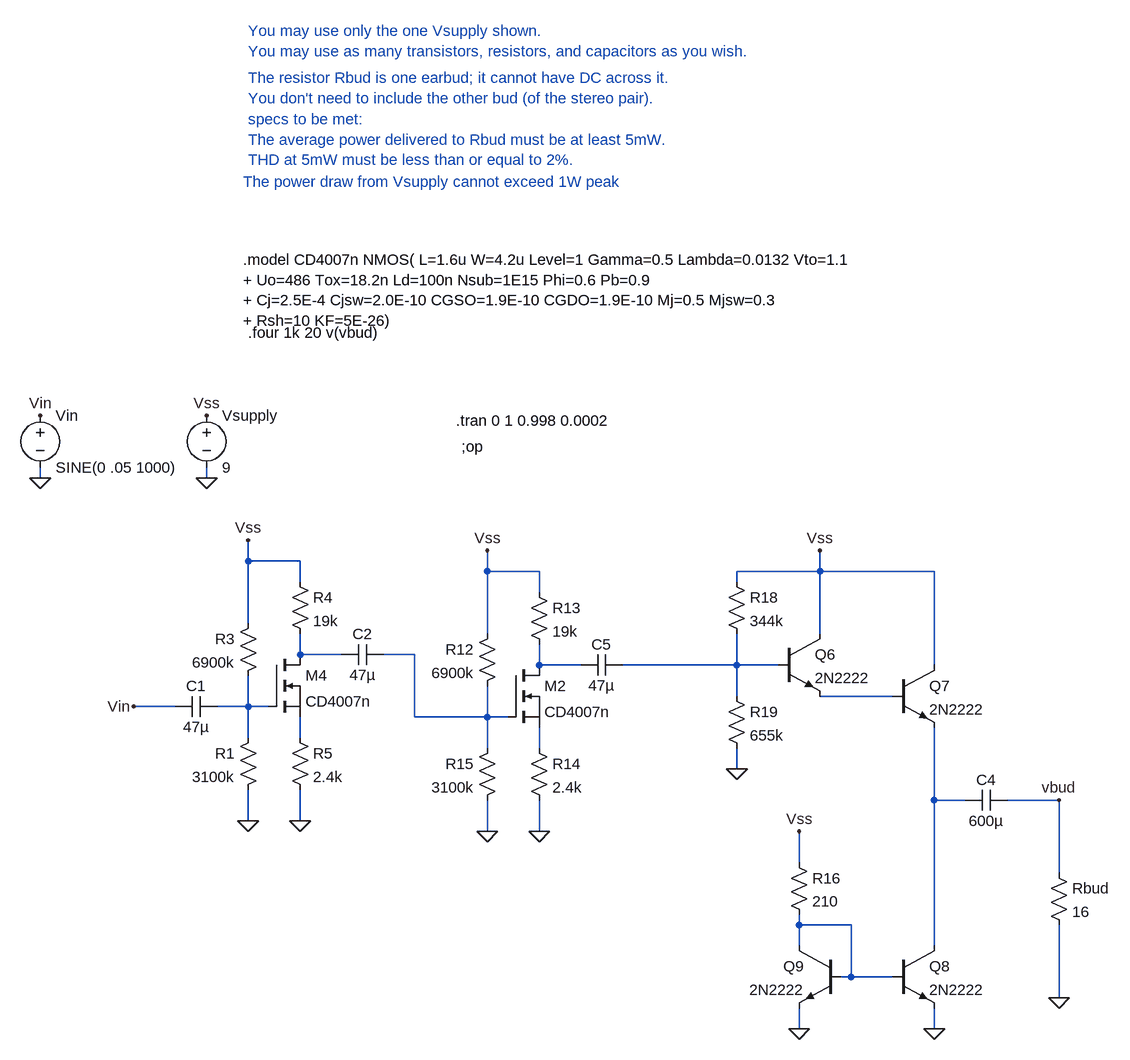
[diagram p0: schematic earbud_amplifier_challenge-1.asc]
earbud_amplifier_challenge-1.asc, the LTspice schematic file:
Version 4
SHEET 1 2240 2180
WIRE 176 1008 176 992
WIRE 432 1008 432 992
WIRE 496 1136 496 1104
WIRE 576 1136 496 1136
WIRE 864 1152 864 1120
WIRE 944 1152 864 1152
WIRE 1376 1152 1376 1120
WIRE 1376 1152 1248 1152
WIRE 1552 1152 1376 1152
WIRE 576 1168 576 1136
WIRE 1248 1168 1248 1152
WIRE 944 1184 944 1152
WIRE 496 1232 496 1136
WIRE 864 1248 864 1152
WIRE 1376 1248 1376 1152
WIRE 576 1280 576 1248
WIRE 640 1280 576 1280
WIRE 752 1280 704 1280
WIRE 944 1296 944 1264
WIRE 1008 1296 944 1296
WIRE 1248 1296 1248 1248
WIRE 1248 1296 1072 1296
WIRE 1312 1296 1248 1296
WIRE 1552 1296 1552 1152
WIRE 1248 1344 1248 1296
WIRE 1488 1344 1376 1344
WIRE 384 1360 320 1360
WIRE 496 1360 496 1312
WIRE 496 1360 448 1360
WIRE 528 1360 496 1360
WIRE 752 1376 752 1280
WIRE 864 1376 864 1328
WIRE 864 1376 752 1376
WIRE 896 1376 864 1376
WIRE 496 1408 496 1360
WIRE 576 1408 576 1376
WIRE 864 1424 864 1376
WIRE 944 1424 944 1392
WIRE 1248 1456 1248 1424
WIRE 1552 1504 1552 1392
WIRE 1600 1504 1552 1504
WIRE 1744 1504 1664 1504
WIRE 496 1536 496 1488
WIRE 576 1536 576 1488
WIRE 864 1552 864 1504
WIRE 944 1552 944 1504
WIRE 1344 1600 1344 1552
WIRE 1744 1616 1744 1504
WIRE 1344 1696 1344 1680
WIRE 1424 1696 1344 1696
WIRE 1344 1728 1344 1696
WIRE 1552 1728 1552 1504
WIRE 1424 1776 1424 1696
WIRE 1424 1776 1408 1776
WIRE 1488 1776 1424 1776
WIRE 1744 1808 1744 1696
WIRE 1344 1856 1344 1824
WIRE 1552 1856 1552 1824
FLAG 176 1008 0
FLAG 432 1008 0
FLAG 432 912 Vss
FLAG 176 912 Vin
FLAG 496 1104 Vss
FLAG 576 1536 0
FLAG 496 1536 0
FLAG 320 1360 Vin
FLAG 864 1120 Vss
FLAG 944 1552 0
FLAG 864 1552 0
FLAG 1744 1504 vbud
FLAG 1344 1552 Vss
FLAG 1344 1856 0
FLAG 1552 1856 0
FLAG 1376 1120 Vss
FLAG 1248 1456 0
FLAG 1744 1808 0
SYMBOL voltage 432 896 R0
SYMATTR InstName Vsupply
SYMATTR Value 9
SYMBOL voltage 176 896 R0
SYMATTR InstName Vin
SYMATTR Value SINE(0 .05 1000)
SYMATTR Value2 AC 1
SYMBOL nmos 528 1280 R0
SYMATTR InstName M4
SYMATTR Value CD4007n
SYMBOL res 512 1216 M0
SYMATTR InstName R3
SYMATTR Value 6900k
SYMBOL res 560 1152 R0
SYMATTR InstName R4
SYMATTR Value 19k
SYMBOL res 560 1392 R0
SYMATTR InstName R5
SYMATTR Value 2.4k
SYMBOL res 512 1392 M0
SYMATTR InstName R1
SYMATTR Value 3100k
SYMBOL cap 448 1344 R90
WINDOW 0 0 32 VBottom 2
WINDOW 3 32 32 VTop 2
SYMATTR InstName C1
SYMATTR Value 47µ
SYMBOL cap 704 1264 R90
WINDOW 0 0 32 VBottom 2
WINDOW 3 32 32 VTop 2
SYMATTR InstName C2
SYMATTR Value 47µ
SYMBOL nmos 896 1296 R0
SYMATTR InstName M2
SYMATTR Value CD4007n
SYMBOL res 880 1232 M0
SYMATTR InstName R12
SYMATTR Value 6900k
SYMBOL res 928 1168 R0
SYMATTR InstName R13
SYMATTR Value 19k
SYMBOL res 928 1408 R0
SYMATTR InstName R14
SYMATTR Value 2.4k
SYMBOL res 880 1408 M0
SYMATTR InstName R15
SYMATTR Value 3100k
SYMBOL cap 1072 1280 R90
WINDOW 0 0 32 VBottom 2
WINDOW 3 32 32 VTop 2
SYMATTR InstName C5
SYMATTR Value 47µ
SYMBOL npn 1312 1248 R0
SYMATTR InstName Q6
SYMATTR Value 2N2222
SYMBOL npn 1488 1296 R0
SYMATTR InstName Q7
SYMATTR Value 2N2222
SYMBOL npn 1488 1728 R0
SYMATTR InstName Q8
SYMATTR Value 2N2222
SYMBOL npn 1408 1728 M0
SYMATTR InstName Q9
SYMATTR Value 2N2222
SYMBOL res 1328 1584 R0
SYMATTR InstName R16
SYMATTR Value 210
SYMBOL res 1232 1152 R0
SYMATTR InstName R18
SYMATTR Value 344k
SYMBOL res 1232 1328 R0
SYMATTR InstName R19
SYMATTR Value 655k
SYMBOL cap 1664 1488 R90
WINDOW 0 0 32 VBottom 2
WINDOW 3 32 32 VTop 2
SYMATTR InstName C4
SYMATTR Value 600µ
SYMBOL res 1728 1600 R0
SYMATTR InstName Rbud
SYMATTR Value 16
TEXT 488 672 Left 2 !.model CD4007n NMOS( L=1.6u W=4.2u Level=1 Gamma=0.5 Lambda=0.0132 Vto=1.1\n+ Uo=486 Tox=18.2n Ld=100n Nsub=1E15 Phi=0.6 Pb=0.9\n+ Cj=2.5E-4 Cjsw=2.0E-10 CGSO=1.9E-10 CGDO=1.9E-10 Mj=0.5 Mjsw=0.3\n+ Rsh=10 KF=5E-26)
TEXT 496 784 Left 2 !.four 1k 20 v(vbud)
TEXT 496 456 Left 2 ;specs to be met: \nThe average power delivered to Rbud must be at least 5mW.\nTHD at 5mW must be less than or equal to 2%.
TEXT 496 320 Left 2 ;You may use only the one Vsupply shown.\nYou may use as many transistors, resistors, and capacitors as you wish.
TEXT 496 392 Left 2 ;The resistor Rbud is one earbud; it cannot have DC across it.\nYou don't need to include the other bud (of the stereo pair).
TEXT 488 552 Left 2 ;The power draw from Vsupply cannot exceed 1W peak
TEXT 824 960 Left 2 !;op
TEXT 816 920 Left 2 !.tran 0 1 0.998 0.0002

The netlist it stands for:
* earbud_amplifier_challenge-1.asc
Vsupply Vss 0 9
Vin Vin 0 SINE(0 .05 1000) AC 1
M4 N001 N006 N007 N007 CD4007n
R3 Vss N006 6900k
R4 Vss N001 19k
R5 N007 0 2.4k
R1 N006 0 3100k
C1 N006 Vin 47µ
C2 N002 N001 47µ
M2 N003 N002 N008 N008 CD4007n
R12 Vss N002 6900k
R13 Vss N003 19k
R14 N008 0 2.4k
R15 N002 0 3100k
C5 N004 N003 47µ
Q6 Vss N004 N005 0 2N2222
Q7 Vss N005 N009 0 2N2222
Q8 N009 N010 0 0 2N2222
Q9 N010 N010 0 0 2N2222
R16 Vss N010 210
R18 Vss N004 344k
R19 N004 0 655k
C4 vbud N009 600µ
Rbud vbud 0 16
.model NPN NPN
.model PNP PNP
.lib standard.bjt
.model NMOS NMOS
.model PMOS PMOS
.lib standard.mos
.model CD4007n NMOS( L=1.6u W=4.2u Level=1 Gamma=0.5 Lambda=0.0132 Vto=1.1
+ Uo=486 Tox=18.2n Ld=100n Nsub=1E15 Phi=0.6 Pb=0.9
+ Cj=2.5E-4 Cjsw=2.0E-10 CGSO=1.9E-10 CGDO=1.9E-10 Mj=0.5 Mjsw=0.3
+ Rsh=10 KF=5E-26)
.four 1k 20 v(vbud)
* specs to be met:
* The average power delivered to Rbud must be at least 5mW.
* THD at 5mW must be less than or equal to 2%.
* You may use only the one Vsupply shown.
* You may use as many transistors, resistors, and capacitors as you wish.
* The resistor Rbud is one earbud; it cannot have DC across it.
* You don't need to include the other bud (of the stereo pair).
* The power draw from Vsupply cannot exceed 1W peak
;op
.tran 0 1 0.998 0.0002
.backanno
.end

* Results of the author's LTspice run, read from the files saved beside the schematic
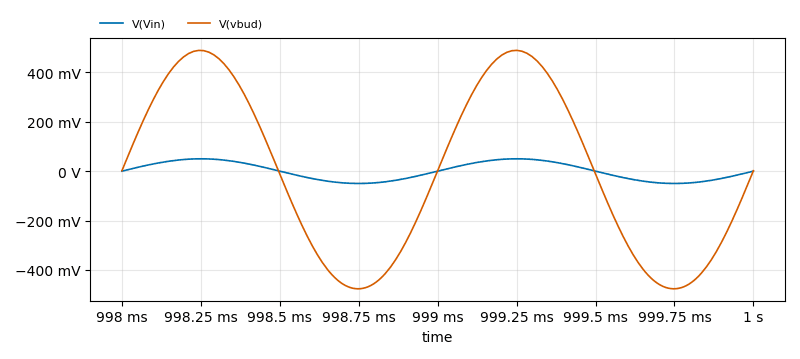
[diagram p1: Transient Analysis of earbud_amplifier_challenge-1.asc, plotted from the saved traces]
* Transient Analysis, 1 run:
*   V(Vin): min -49.96 mV, max 49.97 mV, average -5.518 µV, rms 35.34 mV, last 0 V
*   V(vbud): min -476.4 mV, max 489.1 mV, average -105.8 µV, rms 343.6 mV, last 1.773 mV